# EAGLE design TopSchem (EAGLE 9.4.0)
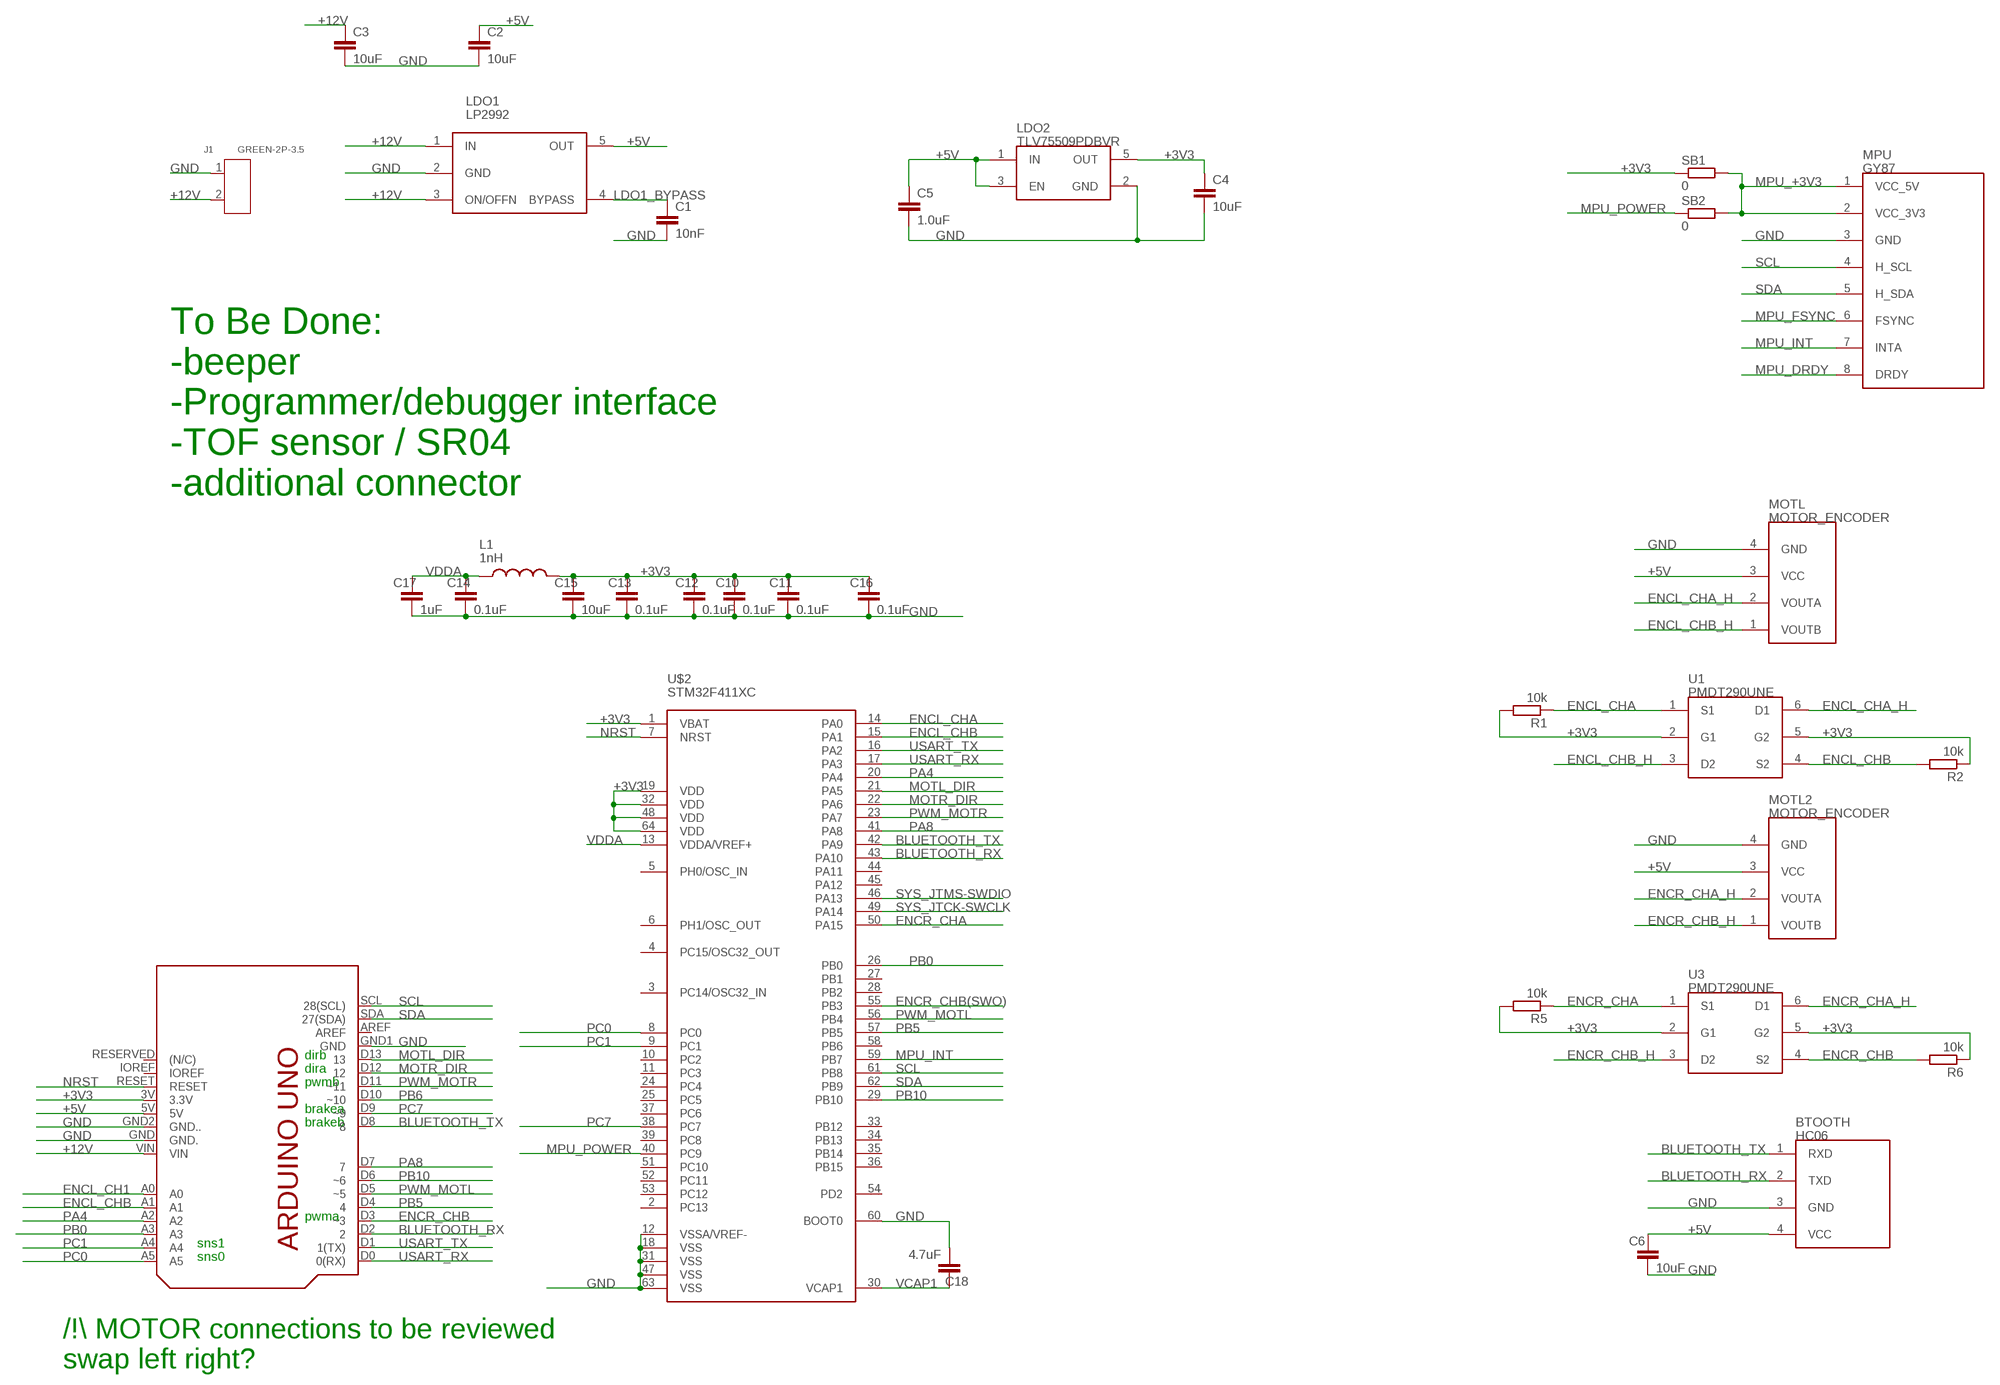
[diagram p0: schematic, sheet 1]

## Parts
BTOOTH  HC06  HC06HC06  [HC06]
C1  10nF  10NF-0603-50V-10%  [0603]
C2  10uF  10UF-0603-6.3V-20%  [0603]
C3  10uF  10UF-0603-6.3V-20%  [0603]
C4  10uF  10UF-0603-6.3V-20%  [0603]
C5  1.0uF  1.0UF-0603-16V-10%  [0603]
C6  10uF  0.1UF-0603-25V-(+80/-20%)  [0603]
C10  0.1uF  0.1UF-0603-25V-(+80/-20%)  [0603]
C11  0.1uF  0.1UF-0603-25V-(+80/-20%)  [0603]
C12  0.1uF  0.1UF-0603-25V-(+80/-20%)  [0603]
C13  0.1uF  0.1UF-0603-25V-(+80/-20%)  [0603]
C14  0.1uF  0.1UF-0603-25V-(+80/-20%)  [0603]
C15  10uF  0.1UF-0603-25V-(+80/-20%)  [0603]
C16  0.1uF  0.1UF-0603-25V-(+80/-20%)  [0603]
C17  1uF  0.1UF-0603-25V-(+80/-20%)  [0603]
C18  4.7uF  0.1UF-0603-25V-(+80/-20%)  [0603]
J1  GREEN-2P-3.5  SCREW-TERMINAL-GREEN(2P-3.5)  [H2-3.5-7.0X7.0MM]
L1  1nH  INDUCTORC0603  [C0603]
LDO1  LP2992  LP2992SOT23-5L  [WE-TVS_SOT23-5L]
LDO2  TLV75509PDBVR  TLV755P  [WE-TVS_SOT23-5L]
MOTL  MOTOR_ENCODER  [ENCODER]
MOTL2  MOTOR_ENCODER  [ENCODER]
MPU  GY87  GY87GY87  [SIP8]
R1  10k  R-EU_R0603  [R0603]
R2  10k  R-EU_R0603  [R0603]
R5  10k  R-EU_R0603  [R0603]
R6  10k  R-EU_R0603  [R0603]
SB1  0  R-EU_R0603  [R0603]
SB2  0  R-EU_R0603  [R0603]
SHIELD  ARDUINO_UNO_EXTARDUINO_R3  [ARDUINOR3]
U1  PMDT290UNE  PMDT290UNESOT666  [SOT666]
U3  PMDT290UNE  PMDT290UNESOT666  [SOT666]
U$2  STM32F411XC  [LQFP64]

## Nets
+3V3: C4.1 C10.1 C11.1 C12.1 C13.1 C15.1 C16.1 L1.2 LDO2.5(OUT) R1.2 R2.1 R5.2 R6.1 SB1.1 SHIELD.3V(3.3V) U1.2(G1) U1.5(G2) U3.2(G1) U3.5(G2) U$2.1(VBAT) U$2.19(VDD) U$2.32(VDD) U$2.48(VDD) U$2.64(VDD)
+5V: BTOOTH.4(VCC) C2.1 C5.1 C6.1 LDO1.5(OUT) LDO2.1(IN) LDO2.3(EN) MOTL2.3(VCC) MOTL.3(VCC) SHIELD.5V
+12V: C3.1 J1.2 LDO1.1(IN) LDO1.3(ON/OFFN) SHIELD.VIN
BLUETOOTH_RX: BTOOTH.2(TXD) SHIELD.D2 U$2.43(PA10)
BLUETOOTH_TX: BTOOTH.1(RXD) SHIELD.D8 U$2.42(PA9)
ENCL_CH1: SHIELD.A0
ENCL_CHA: R1.1 U1.1(S1) U$2.14(PA0)
ENCL_CHA_H: MOTL.2(VOUTA) U1.6(D1)
ENCL_CHB: R2.2 SHIELD.A1 U1.4(S2) U$2.15(PA1)
ENCL_CHB_H: MOTL.1(VOUTB) U1.3(D2)
ENCR_CHA: R5.1 U3.1(S1) U$2.50(PA15)
ENCR_CHA_H: MOTL2.2(VOUTA) U3.6(D1)
ENCR_CHB: R6.2 SHIELD.D3(~3) U3.4(S2)
ENCR_CHB(SWO): U$2.55(PB3)
ENCR_CHB_H: MOTL2.1(VOUTB) U3.3(D2)
GND: BTOOTH.3(GND) C1.2 C2.2 C3.2 C4.2 C5.2 C6.2 C10.2 C11.2 C12.2 C13.2 C14.2 C15.2 C16.2 C17.2 C18.2 J1.1 LDO1.2(GND) LDO2.2(GND) MOTL2.4(GND) MOTL.4(GND) MPU.3(GND) SHIELD.GND1(GND) SHIELD.GND2(GND..) SHIELD.GND(GND.) U$2.12(VSSA/VREF-) U$2.18(VSS) U$2.31(VSS) U$2.47(VSS) U$2.60(BOOT0) U$2.63(VSS)
LDO1_BYPASS: C1.1 LDO1.4(BYPASS)
MOTL_DIR: SHIELD.D13 U$2.21(PA5)
MOTR_DIR: SHIELD.D12 U$2.22(PA6)
MPU_+3V3: MPU.1(VCC_5V) MPU.2(VCC_3V3) SB1.2 SB2.2
MPU_DRDY: MPU.8(DRDY)
MPU_FSYNC: MPU.6(FSYNC)
MPU_INT: MPU.7(INTA) U$2.59(PB7)
MPU_POWER: SB2.1 U$2.40(PC9)
NRST: SHIELD.RESET U$2.7(NRST)
PA4: SHIELD.A2 U$2.20(PA4)
PA8: SHIELD.D7 U$2.41(PA8)
PB0: SHIELD.A3 U$2.26(PB0)
PB5: SHIELD.D4 U$2.57(PB5)
PB6: SHIELD.D10(~10)
PB10: SHIELD.D6(~6) U$2.29(PB10)
PC0: SHIELD.A5 U$2.8(PC0)
PC1: SHIELD.A4 U$2.9(PC1)
PC7: SHIELD.D9(~9) U$2.38(PC7)
PWM_MOTL: SHIELD.D5(~5) U$2.56(PB4)
PWM_MOTR: SHIELD.D11(~11) U$2.23(PA7)
SCL: MPU.4(H_SCL) SHIELD.SCL(28(SCL)) U$2.61(PB8)
SDA: MPU.5(H_SDA) SHIELD.SDA(27(SDA)) U$2.62(PB9)
SYS_JTCK-SWCLK: U$2.49(PA14)
SYS_JTMS-SWDIO: U$2.46(PA13)
USART_RX: SHIELD.D0(0(RX)) U$2.17(PA3)
USART_TX: SHIELD.D1(1(TX)) U$2.16(PA2)
VCAP1: C18.1 U$2.30(VCAP1)
VDDA: C14.1 C17.1 L1.1 U$2.13(VDDA/VREF+)
Unconnected: SHIELD.AREF SHIELD.IOREF SHIELD.RESERVED((N/C)) U$2.2(PC13) U$2.3(PC14/OSC32_IN) U$2.4(PC15/OSC32_OUT) U$2.5(PH0/OSC_IN) U$2.6(PH1/OSC_OUT) U$2.10(PC2) U$2.11(PC3) U$2.24(PC4) U$2.25(PC5) U$2.27(PB1) U$2.28(PB2) U$2.33(PB12) U$2.34(PB13) U$2.35(PB14) U$2.36(PB15) U$2.37(PC6) U$2.39(PC8) U$2.44(PA11) U$2.45(PA12) U$2.51(PC10) U$2.52(PC11) U$2.53(PC12) U$2.54(PD2) U$2.58(PB6)

## Notes on the sheet
- To Be Done:
  -beeper
  -Programmer/debugger interface
  -TOF sensor / SR04
  -additional connector
- dirb
- dira
- pwmb
- brakea
- brakeb
- pwma
- sns1
- sns0
- /\!\\ MOTOR connections to be reviewed
  swap left right?

## Library data of the parts
BTOOTH = myLib:HC06
C1 = SparkFun-Capacitors:10NF: 0.01uF/10nF/10,000pF ceramic capacitors A capacitor is a passive two-terminal electrical component used to store electrical energy temporarily in an electric field. CAP-09321; PROD_ID: CAP-00867
C2-C4 = SparkFun-Capacitors:10UF: 10.0µF ceramic capacitors A capacitor is a passive two-terminal electrical component used to store electrical energy temporarily in an electric field.; PROD_ID: CAP-11015
C5 = SparkFun-Capacitors:1.0UF: 1µF ceramic capacitors A capacitor is a passive two-terminal electrical component used to store electrical energy temporarily in an electric field.; PROD_ID: CAP-00868
C6 C15 C17 C18 = SparkFun-Capacitors:0.1UF: 0.1µF ceramic capacitors A capacitor is a passive two-terminal electrical component used to store electrical energy temporarily in an electric field.; PROD_ID: CAP-00810; VALUE: 0.1uF
C10-C14 C16 = SparkFun-Capacitors:0.1UF: 0.1µF ceramic capacitors A capacitor is a passive two-terminal electrical component used to store electrical energy temporarily in an electric field.; PROD_ID: CAP-00810
J1 = OPL_Connector:SCREW-TERMINAL-GREEN(2P-3.5): 320110028
L1 = myLib:INDUCTOR
LDO1 = myLib:LP2992
LDO2 = myLib:TLV755P
MOTL MOTL2 = myLib:MOTOR_ENCODER
MPU = myLib:GY87
R1 R2 R5 R6 SB1 SB2 = resistor:R-EU_: RESISTOR, European symbol
SHIELD = myLib:ARDUINO_UNO_EXT: Device for representing an Arduino Uno board in an EAGLE design without the PCB footprint. Created by Dave Young for Element14. More EAGLE documentation at: http://www.element14.com/community/community/knode/cadsoft_eagle
U1 U3 = myLib:PMDT290UNE
U$2 = stm32f411:STM32F411XC

## Net classes
0 signals: width 0.3 mm, drill 0.3 mm, clearance 0.2 mm

## Board
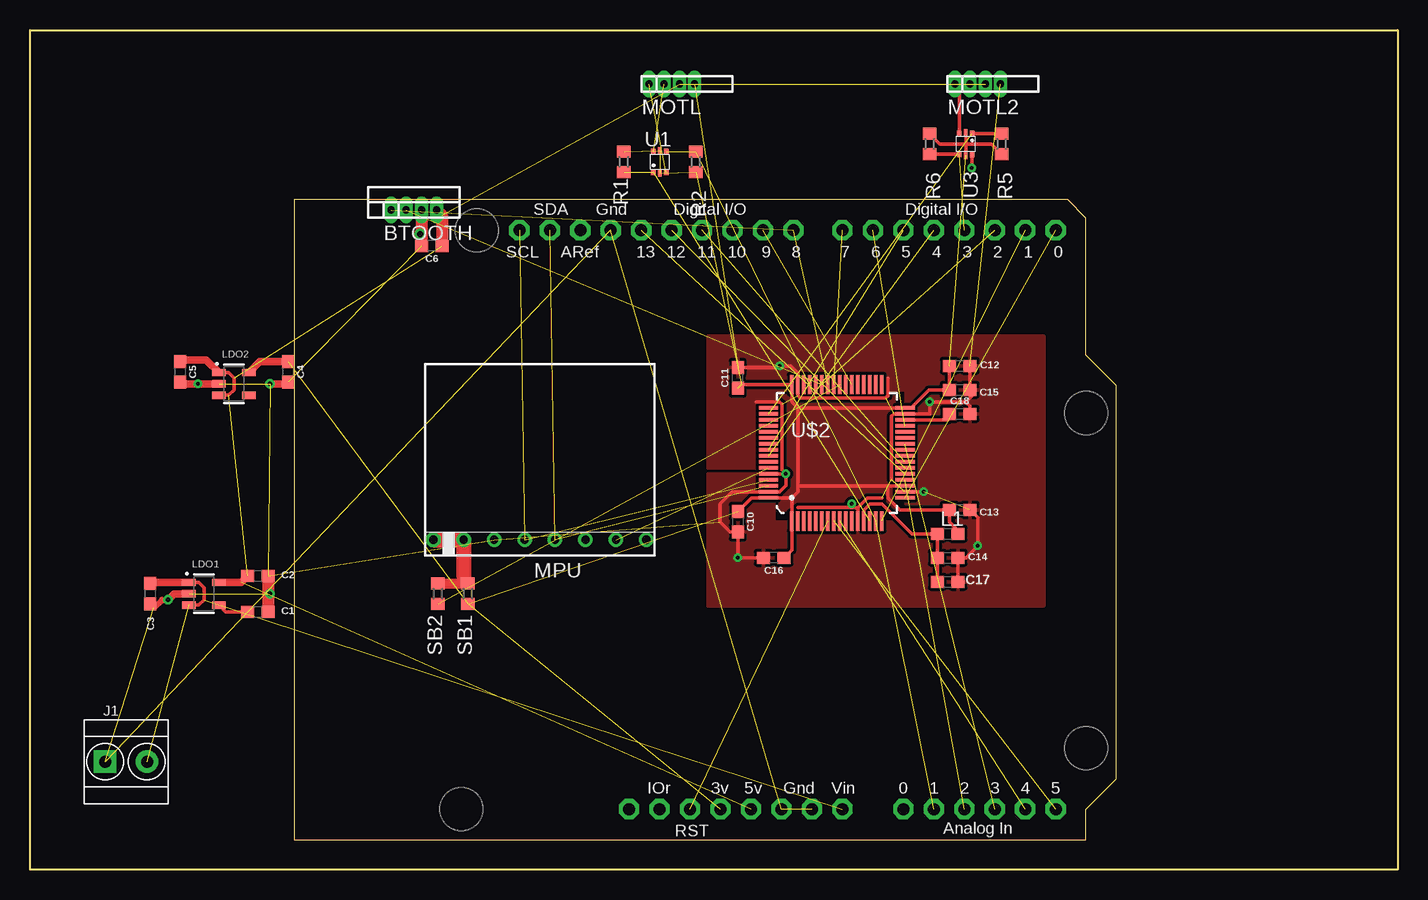
[diagram p1: board, top side]
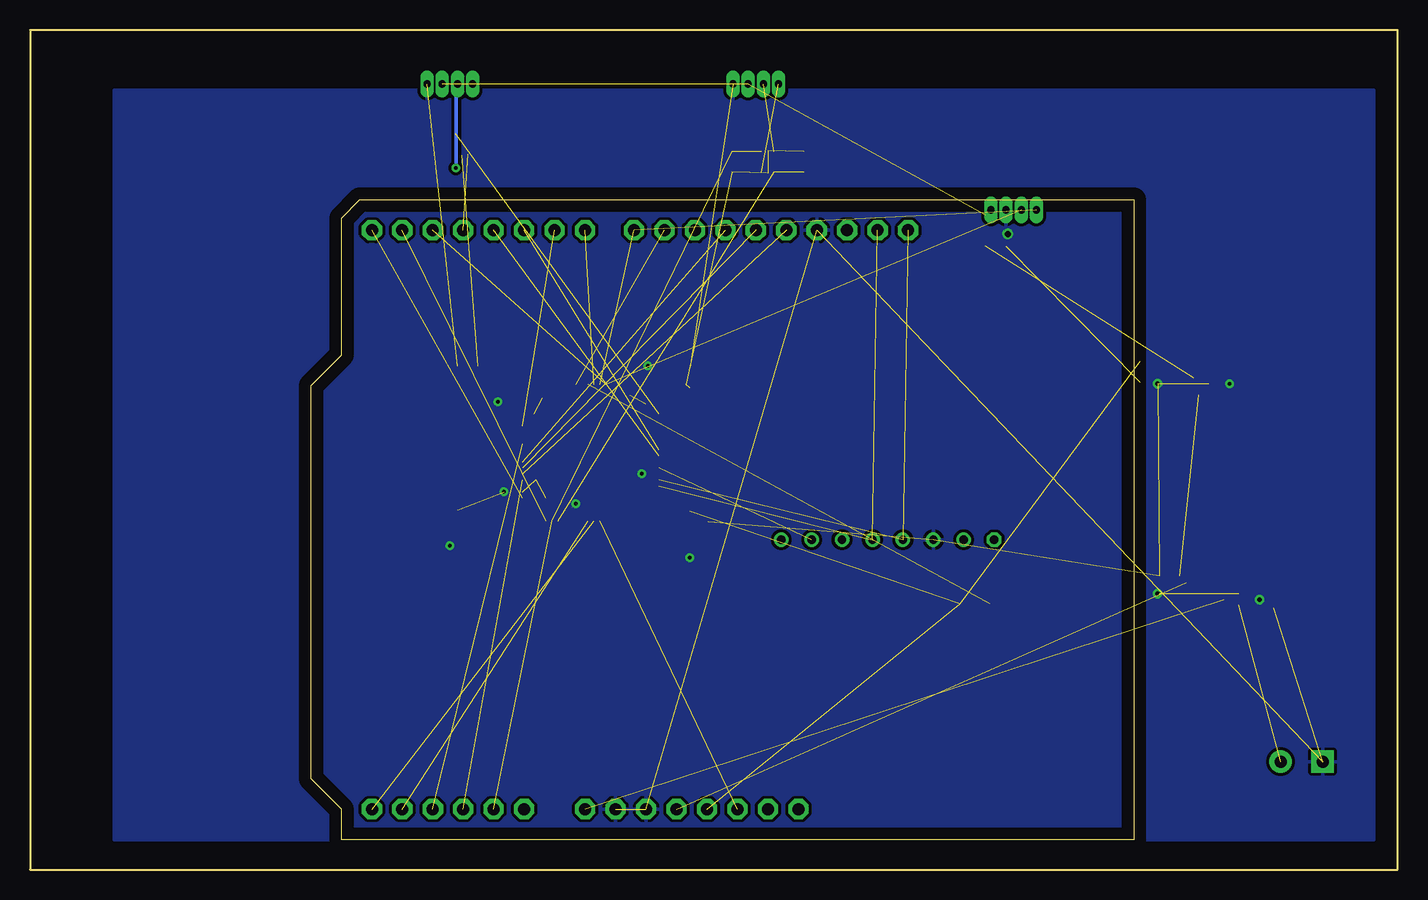
[diagram p2: board, bottom side, seen from below]

Size 114 x 70 mm. Coordinates in mm from the lower left corner, seen from the top.
Outline: 0,0 0,70 114,70 114,0 0,0
Copper layers (1*16): Top 0.035mm / dielectric 1.5mm / Bottom 0.035mm
Design rules "default": minimum track width 6mil, minimum drill 0.35mm, track to track 6mil, track to pad 6mil, pad to pad 6mil, via to via 6mil, smd to smd 6mil, copper to edge 40mil, drill to drill 6mil, minimum pad ring 10mil, minimum via ring 8mil, stop-mask expansion 4mil, vias tented up to drill 0mil, thermal gap 10mil

### Footprints (pad centres in the part's own frame; a part is rotated, then mirrored left to right if it is on the bottom)
HC06 = drill 0.6 pad 0.7 long: 1 -1.905,0; 2 -0.635,0; 3 0.635,0; 4 1.905,0
0603 = smd 1.1 x 1: 1 -0.85,0; 2 0.85,0
H2-3.5-7.0X7.0MM = drill 1 pad 1.85 square: 1 -1.75,0 | drill 1 pad 1.85: 2 1.75,0
C0603 = smd 1.1 x 1: 1 -0.85,0; 2 0.85,0
WE-TVS_SOT23-5L = smd 1.1 x 0.6: 1 -1.25,0.95; 2 -1.25,0; 3 -1.25,-0.95; 4 1.25,-0.95; 5 1.25,0.95
ENCODER = drill 0.6 pad 0.7 long: 1 -1.905,0; 2 -0.635,0; 3 0.635,0; 4 1.905,0
SIP8 = drill 0.7 pad 1.016 octagon: 1 -8.89,0 | drill 0.7 pad 1.016: 2 -6.35,0; 3 -3.81,0; 4 -1.27,0; 5 1.27,0; 6 3.81,0; 7 6.35,0; 8 8.89,0
R0603 = smd 1 x 1.1: 1 -0.85,0; 2 0.85,0
ARDUINOR3 = drill 1 pad 1.676 octagon: 3V 35.56,2.54; 5V 38.1,2.54; A0 50.8,2.54; A1 53.34,2.54; A2 55.88,2.54; A3 58.42,2.54; A4 60.96,2.54; A5 63.5,2.54; AREF 23.876,50.8; D0 63.5,50.8; D1 60.96,50.8; D2 58.42,50.8; D3 55.88,50.8; D4 53.34,50.8; D5 50.8,50.8; D6 48.26,50.8; D7 45.72,50.8; D8 41.656,50.8; D9 39.116,50.8; D10 36.576,50.8; D11 34.036,50.8; D12 31.496,50.8; D13 28.956,50.8; GND 26.416,50.8; GND1 43.18,2.54; GND2 40.64,2.54; IOREF 30.48,2.54; RESERVED 27.94,2.54; RESET 33.02,2.54; SCL 18.796,50.8; SDA 21.336,50.8; VIN 45.72,2.54
SOT666 = smd 0.375 x 0.5: 1 -0.537,-0.85; 3 0.538,-0.85; 4 0.538,0.849; 6 -0.538,0.85 | smd 0.3 x 0.65: 2 0,-0.923; 5 0,0.925
LQFP64 = smd 0.3 x 1.6: 1 -3.75,-5.7; 2 -3.25,-5.7; 3 -2.75,-5.7; 4 -2.25,-5.7; 5 -1.75,-5.7; 6 -1.25,-5.7; 7 -0.75,-5.7; 8 -0.25,-5.7; 9 0.25,-5.7; 10 0.75,-5.7; 11 1.25,-5.7; 12 1.75,-5.7; 13 2.25,-5.7; 14 2.75,-5.7; 15 3.25,-5.7; 16 3.75,-5.7; 33 3.75,5.7; 34 3.25,5.7; 35 2.75,5.7; 36 2.25,5.7; 37 1.75,5.7; 38 1.25,5.7; 39 0.75,5.7; 40 0.25,5.7; 41 -0.25,5.7; 42 -0.75,5.7; 43 -1.25,5.7; 44 -1.75,5.7; 45 -2.25,5.7; 46 -2.75,5.7; 47 -3.25,5.7; 48 -3.75,5.7 | smd 1.6 x 0.3: 17 5.7,-3.75; 18 5.7,-3.25; 19 5.7,-2.75; 20 5.7,-2.25; 21 5.7,-1.75; 22 5.7,-1.25; 23 5.7,-0.75; 24 5.7,-0.25; 25 5.7,0.25; 26 5.7,0.75; 27 5.7,1.25; 28 5.7,1.75; 29 5.7,2.25; 30 5.7,2.75; 31 5.7,3.25; 32 5.7,3.75; 49 -5.7,3.75; 50 -5.7,3.25; 51 -5.7,2.75; 52 -5.7,2.25; 53 -5.7,1.75; 54 -5.7,1.25; 55 -5.7,0.75; 56 -5.7,0.25; 57 -5.7,-0.25; 58 -5.7,-0.75; 59 -5.7,-1.25; 60 -5.7,-1.75; 61 -5.7,-2.25; 62 -5.7,-2.75; 63 -5.7,-3.25; 64 -5.7,-3.75

### Placement (x,y rotation side)
BTOOTH  32,55 0 top
C1  19,21.5 0 top
C2  19,24.5 0 top
C3  10,23 270 top
C4  21.5,41.5 270 top
C5  12.5,41.5 270 top
C6  33.5,52 180 top
C10  59,29 270 top
C11  59,41 90 top
C12  77.5,42 0 top
C13  77.5,30 0 top
C14  76.5,26 0 top
C15  77.5,40 0 top
C16  62,26 180 top
C17  76.5,24 0 top
C18  77.5,38 0 top
J1  8,9 0 top
L1  76.5,28 0 top
LDO1  14.5,23 0 top
LDO2  17,40.5 0 top
MOTL  53.5,65.5 0 top
MOTL2  79,65.5 0 top
MPU  42.5,27.5 0 top
R1  49.5,59 90 top
R2  55.5,59 90 top
R5  81,60.5 270 top
R6  75,60.5 270 top
SB1  36.5,23 90 top
SB2  34,23 90 top
SHIELD  22,2.5 0 top
U1  52.5,59 0 top
U3  78,60.5 180 top
U$2  67.25,34.75 0 top

### Tracks (layer width: path | path; a pad name or v marks a point on that pad's centre or on a via)
+3V3  (9 unrouted)
  Top 0.3: C12.1 C15.1 74.95,40 73.45,38.5 U$2.32 64,38.5 | 77.35,28.3 77.08,28.57 | 77.08,28.57 76.65,29 C13.1 72.5,30 71.5,31 71.5,32 | L1.2 77.08,28.27 77.08,28.57 | 59.3,40.45 U$2.48 63.5,39 64,38.5 | 64,32 71.5,32 | 63.5,31 U$2.1 63.5,26.65 C16.1 | 64,32 64,31.5 63.5,31 | 64,38.5 64,32 | 71.5,32 U$2.19 | 63.5,31 U$2.64 60.15,31 C10.1
  Top 0.305: U3.2 78,60.5 | 78,60.5 U3.5 | R5.2 80.15,60.5 78,60.5 | R6.1 75.85,60.5 78,60.5
  Top 0.61: LDO2.5 19.15,42.35 C4.1
  pour Top (isolate 0.254): 62.5,39.5 72,39.5 72,30 62.5,30
+5V  (5 unrouted)
  Top 0.3: LDO2.1 16.55,41.45 17,41 17,40 16.55,39.55 LDO2.3 | 12.65,42.5 C5.1
  Top 0.61: LDO2.1 14.7,42.5 12.65,42.5 | C2.1 17.6,23.95 LDO1.5
  Top 1.016: BTOOTH.4 34.35,54.55 C6.1
+12V  (2 unrouted)
  Top 0.3: C3.1 10.1,23.95 | LDO1.3 14.05,22.05 14.5,22.5 14.5,23.5 14.05,23.95 LDO1.1
  Top 0.61: 10.1,23.95 LDO1.1
BLUETOOTH_RX  (2 unrouted)
BLUETOOTH_TX  (2 unrouted)
ENCL_CHA  (2 unrouted)
ENCL_CHA_H  (1 unrouted)
ENCL_CHB  (3 unrouted)
ENCL_CHB_H  (1 unrouted)
ENCR_CHA  (1 unrouted)
  Top 0.305: U3.1 R5.1
ENCR_CHA_H  (via drill 0.3)
  Top 0.305: U3.6 78.54,58.54 | 78.54,58.54 78.54,58.5 | v78.5,58.5 78.54,58.54
  Bottom 0.305: MOTL2.2 78.5,65.36 v78.5,58.5
ENCR_CHB  (1 unrouted)
  Top 0.305: U3.4 R6.2
ENCR_CHB_H
  Top 0.305: MOTL2.1 77.46,65.14 77.46,64.57 U3.3
GND  (via drill 0.3, 0.3 pad 0.55, 0.35, 0.5)  (19 unrouted)
  Top 0.3: U$2.18 v74.5,31.5 | C12.2 C15.2 78.5,39.85 78.5,39.5 78,39 | C16.2 v59,26 C10.2 58.35,28.15 57.5,29 57.5,30.5 58.5,31.5 U$2.63 62.49,31.5 63,32.01 v63,33 | 77.5,26 78,26 v79,27 79,29.35 C13.2 | 77.5,26 C14.2 | C17.2 77.35,25.85 77.5,26 | C11.2 62.35,41.85 v62.5,42 63.4,42 64,41.4 U$2.47 64,39.51 64.2,39.3 71.3,39.3 71.5,39.5 71.5,41 | v63,33 U$2.60 | v63,33 62.7,33.3 62.7,38.8 62.49,39 60.5,39 | 71.8,32.5 71.8,37.8 72,38 U$2.31 75,38 v75,39 78,39 | 69,30 68.8,30.2 | 64,30.2 68.8,30.2 | 68.8,30.2 v68.5,30.5 | U$2.12 69,30 | 69,30 69,30.21 69.79,31 71,31 | 78,39 78.35,38.65 C18.2 | 12.65,40.5 C5.2 | C4.2 21.35,40.5 | v20,23 19.85,23
  Top 0.508: C3.2 10.32,21.82 11,22.5 v11.5,22.5
  Top 0.61: LDO2.2 v14,40.5 12.65,40.5 | 21.35,40.5 v20,40.5 | v11.5,22.5 12,23 LDO1.2
  Top 1.016: C2.2 19.85,23 C1.2 | BTOOTH.3 32.63,52.87 | 32.63,52.87 32.63,52.02 C6.2 | v32.5,53 32.63,52.87
  pour Bottom (isolate 0.254): 2,65 107,65 107,2.5 2,2.5
  pour Top (isolate 0.254): 56.5,44.5 84.5,44.5 84.5,22 56.5,22 56.5,33 62,33 62,29 73,29 73,40 62,40 62,33.5 56.5,33.5
LDO1_BYPASS
  Top 0.3: C1.1 16.3,21.5 LDO1.4
MOTL_DIR  (1 unrouted)
MOTR_DIR  (1 unrouted)
MPU_+3V3
  Top 0.813: SB2.2 SB1.2 36.15,24.2 36.15,24.5
  Top 1.27: MPU.1 MPU.2 36.15,24.5
MPU_INT  (1 unrouted)
MPU_POWER  (1 unrouted)
NRST  (1 unrouted)
PA4  (1 unrouted)
PA8  (1 unrouted)
PB0  (1 unrouted)
PB5  (1 unrouted)
PB10  (1 unrouted)
PC0  (1 unrouted)
PC1  (1 unrouted)
PC7  (1 unrouted)
PWM_MOTL  (1 unrouted)
PWM_MOTR  (1 unrouted)
SCL  (2 unrouted)
SDA  (2 unrouted)
USART_RX  (1 unrouted)
USART_TX  (1 unrouted)
VCAP1
  Top 0.3: U$2.30 76.5,37.5 76.65,37.65 C18.1
VDDA
  Top 0.3: U$2.13 69.5,30 70,30.5 71,30.5 73.5,28 L1.1 C14.1 C17.1